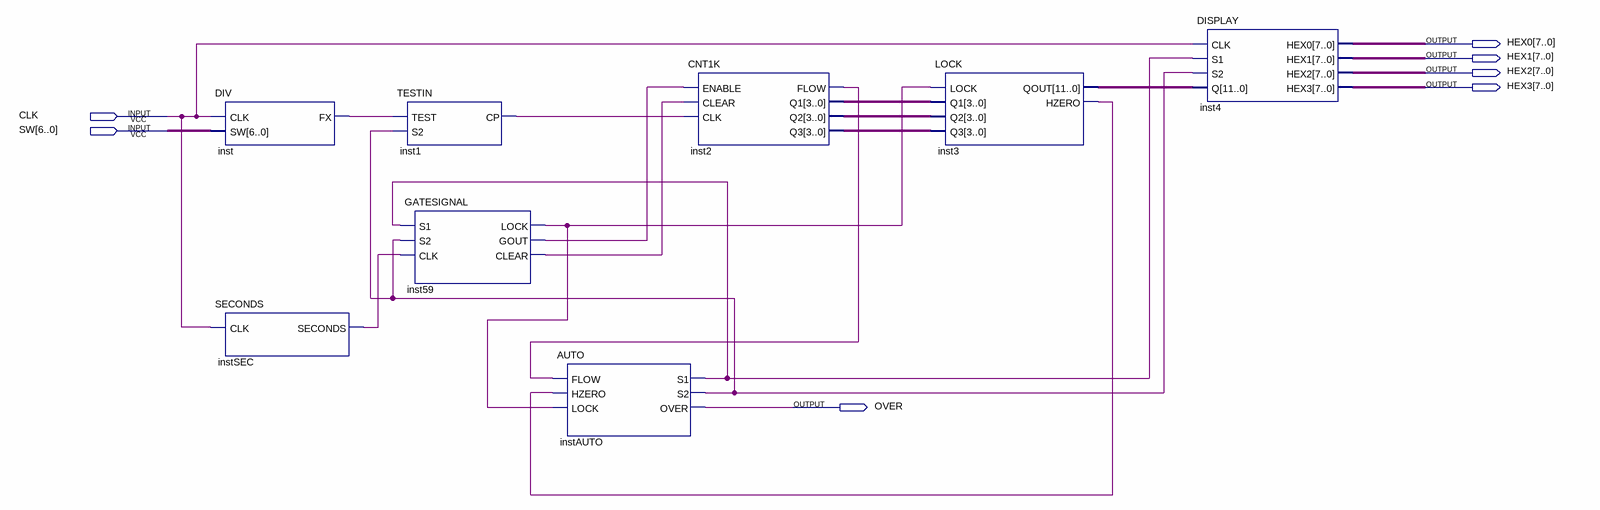
[diagram p0: schematic sheet]
// Quartus schematic Block2.bdf as structural Verilog: 8 symbols, 7 pins
module Block2 (
  input  CLK,
  input  [6:0] SW,
  output [7:0] HEX0,
  output [7:0] HEX1,
  output [7:0] HEX2,
  output [7:0] HEX3,
  output OVER
);

  wire inst1_cp, inst2_flow, inst3_hzero, inst59_clear, inst59_gout, inst59_lock, inst_fx, instAUTO_s1,
       instAUTO_s2, instSEC_seconds;
  wire [3:0] inst2_q1, inst2_q2, inst2_q3;
  wire [11:0] inst3_qout;

  DIV inst (.CLK(CLK), .SW(SW), .FX(inst_fx));
  SECONDS instSEC (.CLK(CLK), .SECONDS(instSEC_seconds));
  TESTIN inst1 (.TEST(inst_fx), .S2(instAUTO_s2), .CP(inst1_cp));
  GATESIGNAL inst59 (
    .S1(instAUTO_s1), .S2(instAUTO_s2), .CLK(instSEC_seconds), .LOCK(inst59_lock), .GOUT(inst59_gout),
    .CLEAR(inst59_clear));
  AUTO instAUTO (
    .FLOW(inst2_flow), .HZERO(inst3_hzero), .LOCK(inst59_lock), .S1(instAUTO_s1), .S2(instAUTO_s2),
    .OVER(OVER));
  CNT1K inst2 (
    .ENABLE(inst59_gout), .CLEAR(inst59_clear), .CLK(inst1_cp), .FLOW(inst2_flow), .Q1(inst2_q1),
    .Q2(inst2_q2), .Q3(inst2_q3));
  LOCK inst3 (.LOCK(inst59_lock), .Q1(inst2_q1), .Q2(inst2_q2), .Q3(inst2_q3), .QOUT(inst3_qout), .HZERO(inst3_hzero));
  DISPLAY inst4 (
    .CLK(CLK), .S1(instAUTO_s1), .S2(instAUTO_s2), .Q(inst3_qout), .HEX0(HEX0), .HEX1(HEX1), .HEX2(HEX2),
    .HEX3(HEX3));
endmodule
